# EAGLE schematic SCH1001-001-009-320 - ALU Bottom (EAGLE 9.4.2)

## Sheet 1 of 4
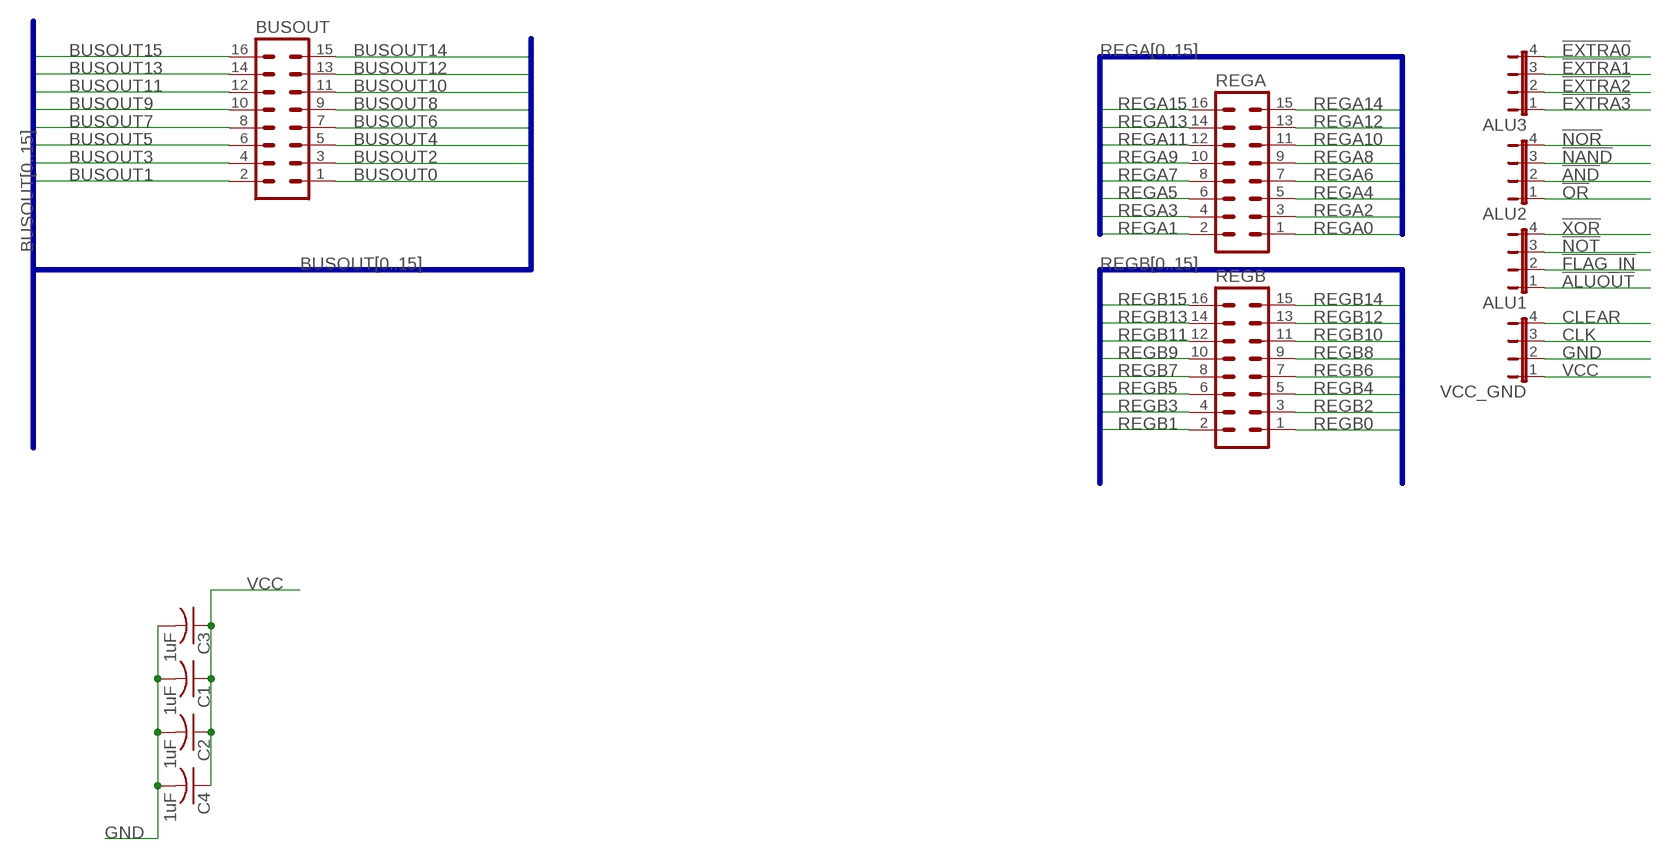
[diagram p0: schematic, sheet 1]

### Parts
ALU1  JP4E  [JP4]
ALU2  JP4E  [JP4]
ALU3  JP4E  [JP4]
BUSOUT  ML16  [ML16]
C1  1uF  C-USC1206  [C1206]
C2  1uF  C-USC1206  [C1206]
C3  1uF  C-USC1206  [C1206]
C4  1uF  C-USC1206  [C1206]
REGA  ML16  [ML16]
REGB  ML16  [ML16]
VCC_GND  JP4E  [JP4]

### Nets
!ALUOUT: ALU1.1
!AND: ALU2.2 ; also sheet 3
!EXTRA0: ALU3.4
!EXTRA1: ALU3.3
!EXTRA2: ALU3.2
!EXTRA3: ALU3.1
!FLAG_IN: ALU1.2
!NAND: ALU2.3 ; also sheet 2
!NOR: ALU2.4 ; also sheet 2
!NOT: ALU1.3 ; also sheet 2
!OR: ALU2.1 ; also sheet 3
!XOR: ALU1.4 ; also sheet 3
BUSOUT0: BUSOUT.1 ; also sheet 2,3
BUSOUT1: BUSOUT.2 ; also sheet 2,3
BUSOUT2: BUSOUT.3 ; also sheet 2,3
BUSOUT3: BUSOUT.4 ; also sheet 2,3
BUSOUT4: BUSOUT.5 ; also sheet 2,3
BUSOUT5: BUSOUT.6 ; also sheet 2,3
BUSOUT6: BUSOUT.7 ; also sheet 2,3
BUSOUT7: BUSOUT.8 ; also sheet 2,3
BUSOUT8: BUSOUT.9 ; also sheet 2,3
BUSOUT9: BUSOUT.10 ; also sheet 2,3
BUSOUT10: BUSOUT.11 ; also sheet 2,3
BUSOUT11: BUSOUT.12 ; also sheet 2,3
BUSOUT12: BUSOUT.13 ; also sheet 2,3
BUSOUT13: BUSOUT.14 ; also sheet 2,3
BUSOUT14: BUSOUT.15 ; also sheet 2,3
BUSOUT15: BUSOUT.16 ; also sheet 2,3
CLEAR: VCC_GND.4
CLK: VCC_GND.3
GND [power]: C1.2 C2.2 C3.2 C4.2 VCC_GND.2
REGA0: REGA.1 ; also sheet 2,3
REGA1: REGA.2 ; also sheet 2,3
REGA2: REGA.3 ; also sheet 2,3
REGA3: REGA.4 ; also sheet 2,3
REGA4: REGA.5 ; also sheet 2,3
REGA5: REGA.6 ; also sheet 2,3
REGA6: REGA.7 ; also sheet 2,3
REGA7: REGA.8 ; also sheet 2,3
REGA8: REGA.9 ; also sheet 2,3
REGA9: REGA.10 ; also sheet 2,3
REGA10: REGA.11 ; also sheet 2,3
REGA11: REGA.12 ; also sheet 2,3
REGA12: REGA.13 ; also sheet 2,3
REGA13: REGA.14 ; also sheet 2,3
REGA14: REGA.15 ; also sheet 2,3
REGA15: REGA.16 ; also sheet 2,3
REGB0: REGB.1 ; also sheet 2,3
REGB1: REGB.2 ; also sheet 2,3
REGB2: REGB.3 ; also sheet 2,3
REGB3: REGB.4 ; also sheet 2,3
REGB4: REGB.5 ; also sheet 2,3
REGB5: REGB.6 ; also sheet 2,3
REGB6: REGB.7 ; also sheet 2,3
REGB7: REGB.8 ; also sheet 2,3
REGB8: REGB.9 ; also sheet 2,3
REGB9: REGB.10 ; also sheet 2,3
REGB10: REGB.11 ; also sheet 2,3
REGB11: REGB.12 ; also sheet 2,3
REGB12: REGB.13 ; also sheet 2,3
REGB13: REGB.14 ; also sheet 2,3
REGB14: REGB.15 ; also sheet 2,3
REGB15: REGB.16 ; also sheet 2,3
VCC [power]: C1.1 C2.1 C3.1 C4.1 VCC_GND.1 ; also sheet 2,3

### Buses
REGB[0..15]
REGA[0..15]
BUSOUT[0..15]

## Sheet 2 of 4
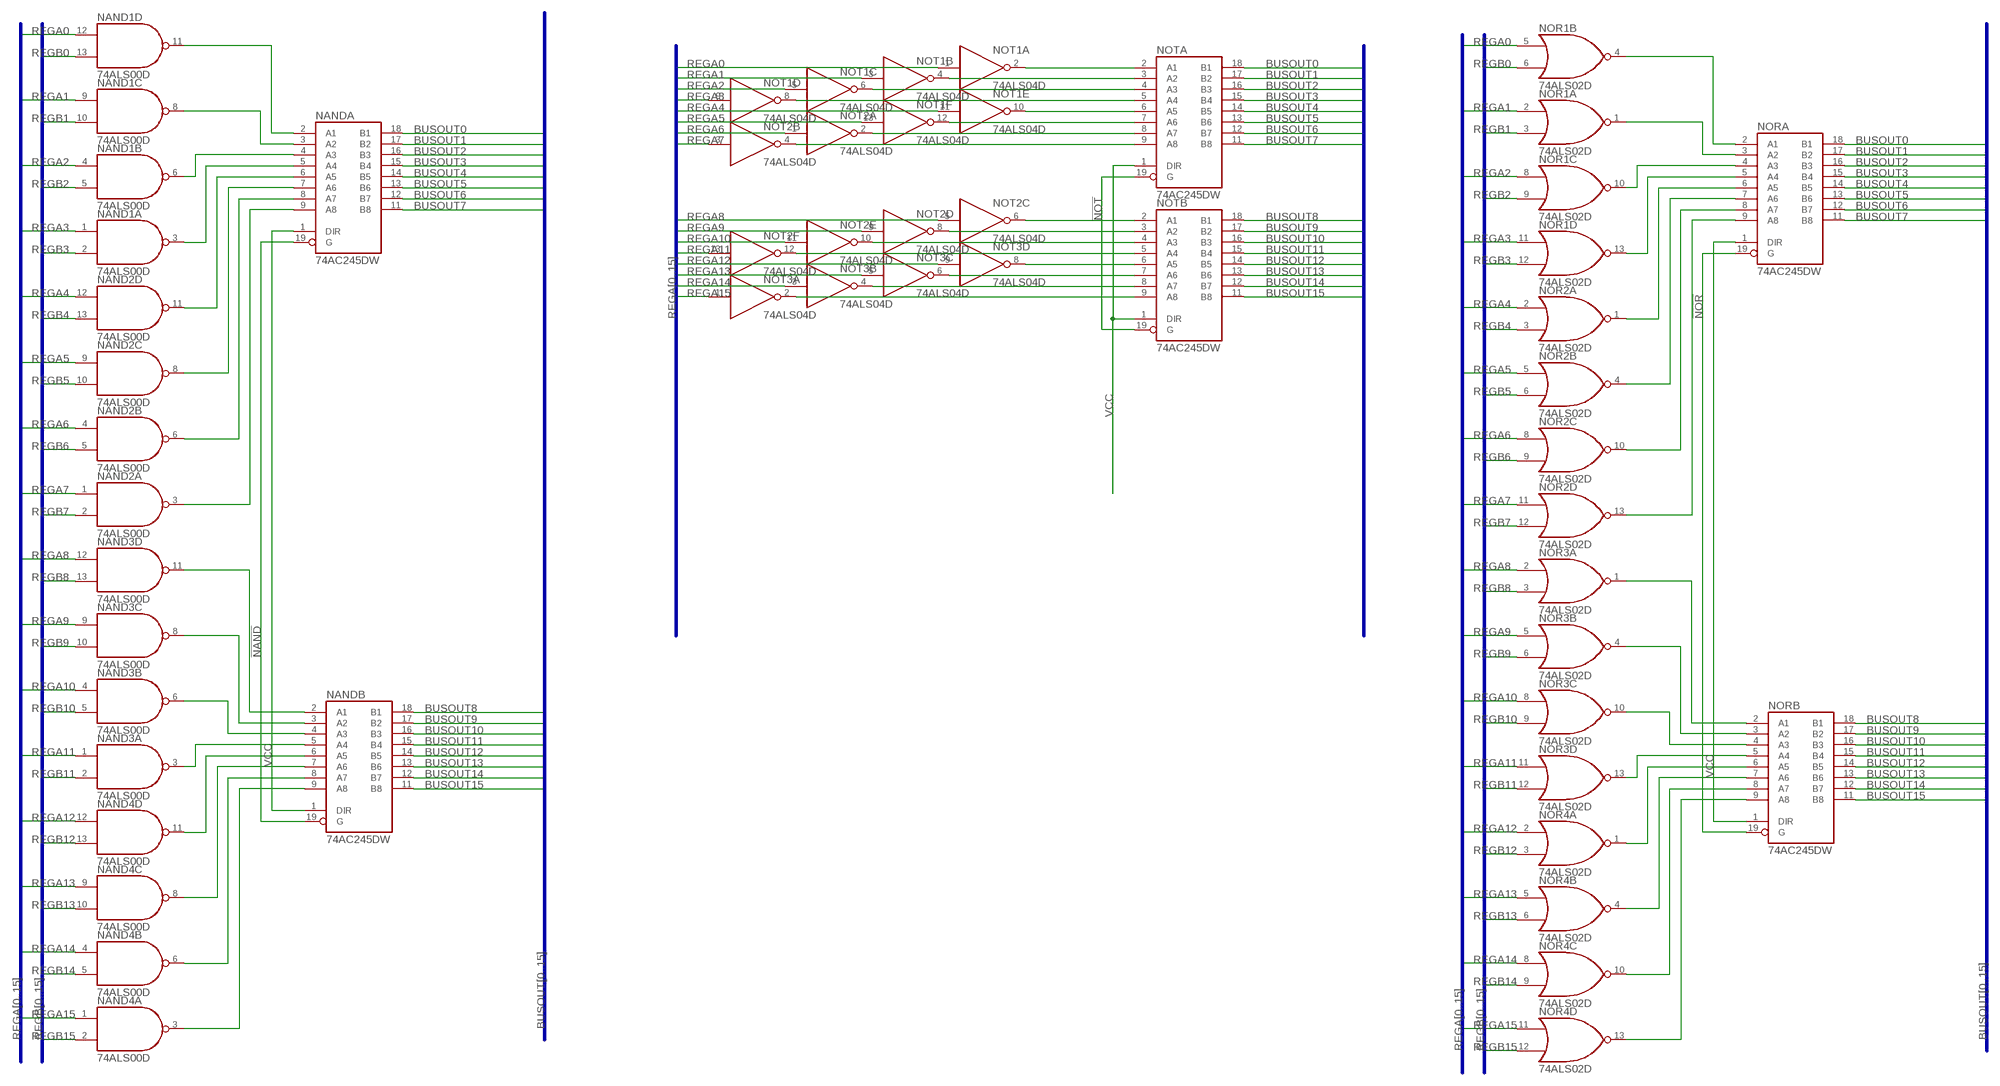
[diagram p1: schematic, sheet 2]

### Parts
NAND1  74ALS00D  [SO14]
NAND2  74ALS00D  [SO14]
NAND3  74ALS00D  [SO14]
NAND4  74ALS00D  [SO14]
NANDA  74AC245DW  [SO20W]
NANDB  74AC245DW  [SO20W]
NOR1  74ALS02D  [SO14]
NOR2  74ALS02D  [SO14]
NOR3  74ALS02D  [SO14]
NOR4  74ALS02D  [SO14]
NORA  74AC245DW  [SO20W]
NORB  74AC245DW  [SO20W]
NOT1  74ALS04D  [SO14]
NOT2  74ALS04D  [SO14]
NOT3  74ALS04D  [SO14]
NOTA  74AC245DW  [SO20W]
NOTB  74AC245DW  [SO20W]

### Nets
!NAND: NANDA.19(G) NANDB.19(G) ; also sheet 1
!NOR: NORA.19(G) NORB.19(G) ; also sheet 1
!NOT: NOTA.19(G) NOTB.19(G) ; also sheet 1
BUSOUT0: NANDA.18(B1) NORA.18(B1) NOTA.18(B1) ; also sheet 1,3
BUSOUT1: NANDA.17(B2) NORA.17(B2) NOTA.17(B2) ; also sheet 1,3
BUSOUT2: NANDA.16(B3) NORA.16(B3) NOTA.16(B3) ; also sheet 1,3
BUSOUT3: NANDA.15(B4) NORA.15(B4) NOTA.15(B4) ; also sheet 1,3
BUSOUT4: NANDA.14(B5) NORA.14(B5) NOTA.14(B5) ; also sheet 1,3
BUSOUT5: NANDA.13(B6) NORA.13(B6) NOTA.13(B6) ; also sheet 1,3
BUSOUT6: NANDA.12(B7) NORA.12(B7) NOTA.12(B7) ; also sheet 1,3
BUSOUT7: NANDA.11(B8) NORA.11(B8) NOTA.11(B8) ; also sheet 1,3
BUSOUT8: NANDB.18(B1) NORB.18(B1) NOTB.18(B1) ; also sheet 1,3
BUSOUT9: NANDB.17(B2) NORB.17(B2) NOTB.17(B2) ; also sheet 1,3
BUSOUT10: NANDB.16(B3) NORB.16(B3) NOTB.16(B3) ; also sheet 1,3
BUSOUT11: NANDB.15(B4) NORB.15(B4) NOTB.15(B4) ; also sheet 1,3
BUSOUT12: NANDB.14(B5) NORB.14(B5) NOTB.14(B5) ; also sheet 1,3
BUSOUT13: NANDB.13(B6) NORB.13(B6) NOTB.13(B6) ; also sheet 1,3
BUSOUT14: NANDB.12(B7) NORB.12(B7) NOTB.12(B7) ; also sheet 1,3
BUSOUT15: NANDB.11(B8) NORB.11(B8) NOTB.11(B8) ; also sheet 1,3
N$1: NOT1.2(A:O) NOTA.2(A1)
N$2: NOT1.10(E:O) NOTA.6(A5)
N$3: NOT1.4(B:O) NOTA.3(A2)
N$4: NOT1.12(F:O) NOTA.7(A6)
N$5: NOT2.2(A:O) NOTA.8(A7)
N$6: NOT1.6(C:O) NOTA.4(A3)
N$7: NOT1.8(D:O) NOTA.5(A4)
N$8: NOT2.4(B:O) NOTA.9(A8)
N$9: NOT2.6(C:O) NOTB.2(A1)
N$10: NOT3.8(D:O) NOTB.6(A5)
N$11: NOT2.8(D:O) NOTB.3(A2)
N$12: NOT3.6(C:O) NOTB.7(A6)
N$13: NOT3.4(B:O) NOTB.8(A7)
N$14: NOT2.10(E:O) NOTB.4(A3)
N$15: NOT2.12(F:O) NOTB.5(A4)
N$16: NOT3.2(A:O) NOTB.9(A8)
N$65: NAND1.11(D:O) NANDA.2(A1)
N$66: NAND1.8(C:O) NANDA.3(A2)
N$67: NAND1.6(B:O) NANDA.4(A3)
N$68: NAND1.3(A:O) NANDA.5(A4)
N$69: NAND2.11(D:O) NANDA.6(A5)
N$70: NAND2.8(C:O) NANDA.7(A6)
N$71: NAND2.6(B:O) NANDA.8(A7)
N$72: NAND2.3(A:O) NANDA.9(A8)
N$73: NAND3.11(D:O) NANDB.2(A1)
N$74: NAND3.8(C:O) NANDB.3(A2)
N$75: NAND3.6(B:O) NANDB.4(A3)
N$76: NAND3.3(A:O) NANDB.5(A4)
N$77: NAND4.11(D:O) NANDB.6(A5)
N$78: NAND4.8(C:O) NANDB.7(A6)
N$79: NAND4.6(B:O) NANDB.8(A7)
N$80: NAND4.3(A:O) NANDB.9(A8)
N$81: NOR1.4(B:O) NORA.2(A1)
N$82: NOR1.1(A:O) NORA.3(A2)
N$83: NOR1.10(C:O) NORA.4(A3)
N$84: NOR1.13(D:O) NORA.5(A4)
N$85: NOR2.1(A:O) NORA.6(A5)
N$86: NOR2.4(B:O) NORA.7(A6)
N$87: NOR2.10(C:O) NORA.8(A7)
N$88: NOR2.13(D:O) NORA.9(A8)
N$89: NOR3.1(A:O) NORB.2(A1)
N$90: NOR3.4(B:O) NORB.3(A2)
N$91: NOR3.10(C:O) NORB.4(A3)
N$92: NOR3.13(D:O) NORB.5(A4)
N$93: NOR4.1(A:O) NORB.6(A5)
N$94: NOR4.4(B:O) NORB.7(A6)
N$95: NOR4.10(C:O) NORB.8(A7)
N$96: NOR4.13(D:O) NORB.9(A8)
REGA0: NAND1.12(D:I0) NOR1.5(B:I0) NOT1.1(A:I) ; also sheet 1,3
REGA1: NAND1.9(C:I0) NOR1.2(A:I0) NOT1.3(B:I) ; also sheet 1,3
REGA2: NAND1.4(B:I0) NOR1.8(C:I0) NOT1.5(C:I) ; also sheet 1,3
REGA3: NAND1.1(A:I0) NOR1.11(D:I0) NOT1.9(D:I) ; also sheet 1,3
REGA4: NAND2.12(D:I0) NOR2.2(A:I0) NOT1.11(E:I) ; also sheet 1,3
REGA5: NAND2.9(C:I0) NOR2.5(B:I0) NOT1.13(F:I) ; also sheet 1,3
REGA6: NAND2.4(B:I0) NOR2.8(C:I0) NOT2.1(A:I) ; also sheet 1,3
REGA7: NAND2.1(A:I0) NOR2.11(D:I0) NOT2.3(B:I) ; also sheet 1,3
REGA8: NAND3.12(D:I0) NOR3.2(A:I0) NOT2.5(C:I) ; also sheet 1,3
REGA9: NAND3.9(C:I0) NOR3.5(B:I0) NOT2.9(D:I) ; also sheet 1,3
REGA10: NAND3.4(B:I0) NOR3.8(C:I0) NOT2.11(E:I) ; also sheet 1,3
REGA11: NAND3.1(A:I0) NOR3.11(D:I0) NOT2.13(F:I) ; also sheet 1,3
REGA12: NAND4.12(D:I0) NOR4.2(A:I0) NOT3.9(D:I) ; also sheet 1,3
REGA13: NAND4.9(C:I0) NOR4.5(B:I0) NOT3.5(C:I) ; also sheet 1,3
REGA14: NAND4.4(B:I0) NOR4.8(C:I0) NOT3.3(B:I) ; also sheet 1,3
REGA15: NAND4.1(A:I0) NOR4.11(D:I0) NOT3.1(A:I) ; also sheet 1,3
REGB0: NAND1.13(D:I1) NOR1.6(B:I1) ; also sheet 1,3
REGB1: NAND1.10(C:I1) NOR1.3(A:I1) ; also sheet 1,3
REGB2: NAND1.5(B:I1) NOR1.9(C:I1) ; also sheet 1,3
REGB3: NAND1.2(A:I1) NOR1.12(D:I1) ; also sheet 1,3
REGB4: NAND2.13(D:I1) NOR2.3(A:I1) ; also sheet 1,3
REGB5: NAND2.10(C:I1) NOR2.6(B:I1) ; also sheet 1,3
REGB6: NAND2.5(B:I1) NOR2.9(C:I1) ; also sheet 1,3
REGB7: NAND2.2(A:I1) NOR2.12(D:I1) ; also sheet 1,3
REGB8: NAND3.13(D:I1) NOR3.3(A:I1) ; also sheet 1,3
REGB9: NAND3.10(C:I1) NOR3.6(B:I1) ; also sheet 1,3
REGB10: NAND3.5(B:I1) NOR3.9(C:I1) ; also sheet 1,3
REGB11: NAND3.2(A:I1) NOR3.12(D:I1) ; also sheet 1,3
REGB12: NAND4.13(D:I1) NOR4.3(A:I1) ; also sheet 1,3
REGB13: NAND4.10(C:I1) NOR4.6(B:I1) ; also sheet 1,3
REGB14: NAND4.5(B:I1) NOR4.9(C:I1) ; also sheet 1,3
REGB15: NAND4.2(A:I1) NOR4.12(D:I1) ; also sheet 1,3
VCC [power]: NANDA.1(DIR) NANDB.1(DIR) NORA.1(DIR) NORB.1(DIR) NOTA.1(DIR) NOTB.1(DIR) ; also sheet 1,3
Unconnected: NOT3.10(E:O) NOT3.11(E:I) NOT3.12(F:O) NOT3.13(F:I)

### Buses
REGA[0..15]
BUSOUT[0..15]
REGB[0..15]

## Sheet 3 of 4
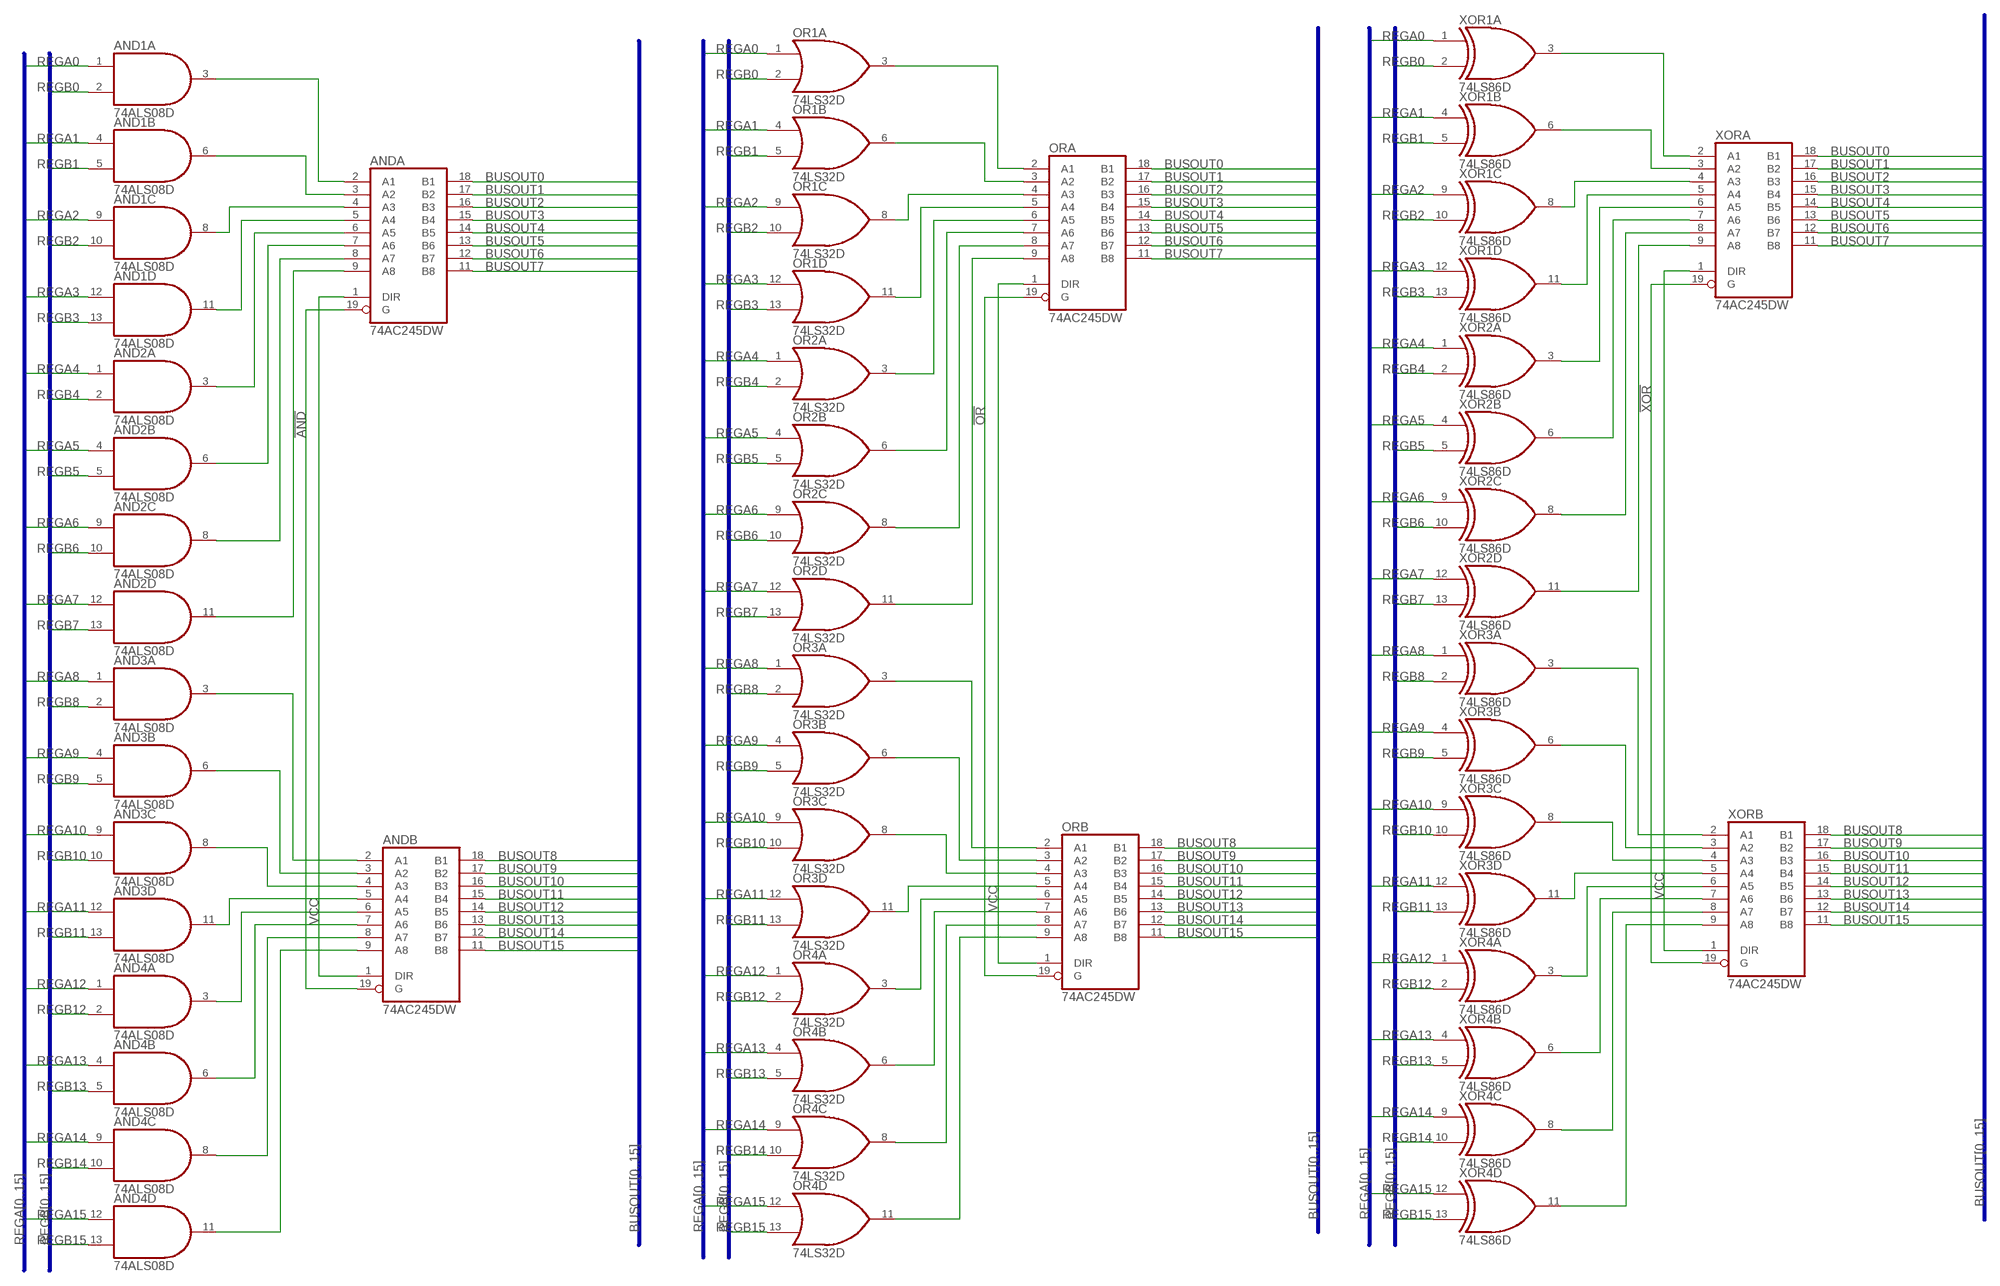
[diagram p2: schematic, sheet 3]

### Parts
AND1  74ALS08D  [SO14]
AND2  74ALS08D  [SO14]
AND3  74ALS08D  [SO14]
AND4  74ALS08D  [SO14]
ANDA  74AC245DW  [SO20W]
ANDB  74AC245DW  [SO20W]
OR1  74LS32D  [SO14]
OR2  74LS32D  [SO14]
OR3  74LS32D  [SO14]
OR4  74LS32D  [SO14]
ORA  74AC245DW  [SO20W]
ORB  74AC245DW  [SO20W]
XOR1  74LS86D  [SO14]
XOR2  74LS86D  [SO14]
XOR3  74LS86D  [SO14]
XOR4  74LS86D  [SO14]
XORA  74AC245DW  [SO20W]
XORB  74AC245DW  [SO20W]

### Nets
!AND: ANDA.19(G) ANDB.19(G) ; also sheet 1
!OR: ORA.19(G) ORB.19(G) ; also sheet 1
!XOR: XORA.19(G) XORB.19(G) ; also sheet 1
BUSOUT0: ANDA.18(B1) ORA.18(B1) XORA.18(B1) ; also sheet 1,2
BUSOUT1: ANDA.17(B2) ORA.17(B2) XORA.17(B2) ; also sheet 1,2
BUSOUT2: ANDA.16(B3) ORA.16(B3) XORA.16(B3) ; also sheet 1,2
BUSOUT3: ANDA.15(B4) ORA.15(B4) XORA.15(B4) ; also sheet 1,2
BUSOUT4: ANDA.14(B5) ORA.14(B5) XORA.14(B5) ; also sheet 1,2
BUSOUT5: ANDA.13(B6) ORA.13(B6) XORA.13(B6) ; also sheet 1,2
BUSOUT6: ANDA.12(B7) ORA.12(B7) XORA.12(B7) ; also sheet 1,2
BUSOUT7: ANDA.11(B8) ORA.11(B8) XORA.11(B8) ; also sheet 1,2
BUSOUT8: ANDB.18(B1) ORB.18(B1) XORB.18(B1) ; also sheet 1,2
BUSOUT9: ANDB.17(B2) ORB.17(B2) XORB.17(B2) ; also sheet 1,2
BUSOUT10: ANDB.16(B3) ORB.16(B3) XORB.16(B3) ; also sheet 1,2
BUSOUT11: ANDB.15(B4) ORB.15(B4) XORB.15(B4) ; also sheet 1,2
BUSOUT12: ANDB.14(B5) ORB.14(B5) XORB.14(B5) ; also sheet 1,2
BUSOUT13: ANDB.13(B6) ORB.13(B6) XORB.13(B6) ; also sheet 1,2
BUSOUT14: ANDB.12(B7) ORB.12(B7) XORB.12(B7) ; also sheet 1,2
BUSOUT15: ANDB.11(B8) ORB.11(B8) XORB.11(B8) ; also sheet 1,2
N$17: AND1.3(A:O) ANDA.2(A1)
N$18: AND1.6(B:O) ANDA.3(A2)
N$19: AND1.8(C:O) ANDA.4(A3)
N$20: AND1.11(D:O) ANDA.5(A4)
N$21: AND2.3(A:O) ANDA.6(A5)
N$22: AND2.6(B:O) ANDA.7(A6)
N$23: AND2.8(C:O) ANDA.8(A7)
N$24: AND2.11(D:O) ANDA.9(A8)
N$25: AND3.3(A:O) ANDB.2(A1)
N$26: AND3.6(B:O) ANDB.3(A2)
N$27: AND3.8(C:O) ANDB.4(A3)
N$28: AND3.11(D:O) ANDB.5(A4)
N$29: AND4.3(A:O) ANDB.6(A5)
N$30: AND4.6(B:O) ANDB.7(A6)
N$31: AND4.8(C:O) ANDB.8(A7)
N$32: AND4.11(D:O) ANDB.9(A8)
N$33: OR1.3(A:O) ORA.2(A1)
N$34: OR1.6(B:O) ORA.3(A2)
N$35: OR1.8(C:O) ORA.4(A3)
N$36: OR1.11(D:O) ORA.5(A4)
N$37: OR2.3(A:O) ORA.6(A5)
N$38: OR2.6(B:O) ORA.7(A6)
N$39: OR2.8(C:O) ORA.8(A7)
N$40: OR2.11(D:O) ORA.9(A8)
N$41: OR3.3(A:O) ORB.2(A1)
N$42: OR3.6(B:O) ORB.3(A2)
N$43: OR3.8(C:O) ORB.4(A3)
N$44: OR3.11(D:O) ORB.5(A4)
N$45: OR4.3(A:O) ORB.6(A5)
N$46: OR4.6(B:O) ORB.7(A6)
N$47: OR4.8(C:O) ORB.8(A7)
N$48: OR4.11(D:O) ORB.9(A8)
N$49: XOR1.3(A:O) XORA.2(A1)
N$50: XOR1.6(B:O) XORA.3(A2)
N$51: XOR1.8(C:O) XORA.4(A3)
N$52: XOR1.11(D:O) XORA.5(A4)
N$53: XOR2.3(A:O) XORA.6(A5)
N$54: XOR2.6(B:O) XORA.7(A6)
N$55: XOR2.8(C:O) XORA.8(A7)
N$56: XOR2.11(D:O) XORA.9(A8)
N$57: XOR3.3(A:O) XORB.2(A1)
N$58: XOR3.6(B:O) XORB.3(A2)
N$59: XOR3.8(C:O) XORB.4(A3)
N$60: XOR3.11(D:O) XORB.5(A4)
N$61: XOR4.3(A:O) XORB.6(A5)
N$62: XOR4.6(B:O) XORB.7(A6)
N$63: XOR4.8(C:O) XORB.8(A7)
N$64: XOR4.11(D:O) XORB.9(A8)
REGA0: AND1.1(A:I0) OR1.1(A:I0) XOR1.1(A:I0) ; also sheet 1,2
REGA1: AND1.4(B:I0) OR1.4(B:I0) XOR1.4(B:I0) ; also sheet 1,2
REGA2: AND1.9(C:I0) OR1.9(C:I0) XOR1.9(C:I0) ; also sheet 1,2
REGA3: AND1.12(D:I0) OR1.12(D:I0) XOR1.12(D:I0) ; also sheet 1,2
REGA4: AND2.1(A:I0) OR2.1(A:I0) XOR2.1(A:I0) ; also sheet 1,2
REGA5: AND2.4(B:I0) OR2.4(B:I0) XOR2.4(B:I0) ; also sheet 1,2
REGA6: AND2.9(C:I0) OR2.9(C:I0) XOR2.9(C:I0) ; also sheet 1,2
REGA7: AND2.12(D:I0) OR2.12(D:I0) XOR2.12(D:I0) ; also sheet 1,2
REGA8: AND3.1(A:I0) OR3.1(A:I0) XOR3.1(A:I0) ; also sheet 1,2
REGA9: AND3.4(B:I0) OR3.4(B:I0) XOR3.4(B:I0) ; also sheet 1,2
REGA10: AND3.9(C:I0) OR3.9(C:I0) XOR3.9(C:I0) ; also sheet 1,2
REGA11: AND3.12(D:I0) OR3.12(D:I0) XOR3.12(D:I0) ; also sheet 1,2
REGA12: AND4.1(A:I0) OR4.1(A:I0) XOR4.1(A:I0) ; also sheet 1,2
REGA13: AND4.4(B:I0) OR4.4(B:I0) XOR4.4(B:I0) ; also sheet 1,2
REGA14: AND4.9(C:I0) OR4.9(C:I0) XOR4.9(C:I0) ; also sheet 1,2
REGA15: AND4.12(D:I0) OR4.12(D:I0) XOR4.12(D:I0) ; also sheet 1,2
REGB0: AND1.2(A:I1) OR1.2(A:I1) XOR1.2(A:I1) ; also sheet 1,2
REGB1: AND1.5(B:I1) OR1.5(B:I1) XOR1.5(B:I1) ; also sheet 1,2
REGB2: AND1.10(C:I1) OR1.10(C:I1) XOR1.10(C:I1) ; also sheet 1,2
REGB3: AND1.13(D:I1) OR1.13(D:I1) XOR1.13(D:I1) ; also sheet 1,2
REGB4: AND2.2(A:I1) OR2.2(A:I1) XOR2.2(A:I1) ; also sheet 1,2
REGB5: AND2.5(B:I1) OR2.5(B:I1) XOR2.5(B:I1) ; also sheet 1,2
REGB6: AND2.10(C:I1) OR2.10(C:I1) XOR2.10(C:I1) ; also sheet 1,2
REGB7: AND2.13(D:I1) OR2.13(D:I1) XOR2.13(D:I1) ; also sheet 1,2
REGB8: AND3.2(A:I1) OR3.2(A:I1) XOR3.2(A:I1) ; also sheet 1,2
REGB9: AND3.5(B:I1) OR3.5(B:I1) XOR3.5(B:I1) ; also sheet 1,2
REGB10: AND3.10(C:I1) OR3.10(C:I1) XOR3.10(C:I1) ; also sheet 1,2
REGB11: AND3.13(D:I1) OR3.13(D:I1) XOR3.13(D:I1) ; also sheet 1,2
REGB12: AND4.2(A:I1) OR4.2(A:I1) XOR4.2(A:I1) ; also sheet 1,2
REGB13: AND4.5(B:I1) OR4.5(B:I1) XOR4.5(B:I1) ; also sheet 1,2
REGB14: AND4.10(C:I1) OR4.10(C:I1) XOR4.10(C:I1) ; also sheet 1,2
REGB15: AND4.13(D:I1) OR4.13(D:I1) XOR4.13(D:I1) ; also sheet 1,2
VCC [power]: ANDA.1(DIR) ANDB.1(DIR) ORA.1(DIR) ORB.1(DIR) XORA.1(DIR) XORB.1(DIR) ; also sheet 1,2

### Buses
REGA[0..15]
REGB[0..15]
BUSOUT[0..15]

## Sheet 4 of 4

## Power pins joined to a net without a drawn wire
GND: AND1.7(P:GND) AND2.7(P:GND) AND3.7(P:GND) AND4.7(P:GND) ANDA.10(GND) ANDB.10(GND) NAND1.7(P:GND) NAND2.7(P:GND) NAND3.7(P:GND) NAND4.7(P:GND) NANDA.10(GND) NANDB.10(GND) NOR1.7(P:GND) NOR2.7(P:GND) NOR3.7(P:GND) NOR4.7(P:GND) NORA.10(GND) NORB.10(GND) NOT1.7(P:GND) NOT2.7(P:GND) NOT3.7(P:GND) NOTA.10(GND) NOTB.10(GND) OR1.7(P:GND) OR2.7(P:GND) OR3.7(P:GND) OR4.7(P:GND) ORA.10(GND) ORB.10(GND) XOR1.7(P:GND) XOR2.7(P:GND) XOR3.7(P:GND) XOR4.7(P:GND) XORA.10(GND) XORB.10(GND)
VCC: AND1.14(P:VCC) AND2.14(P:VCC) AND3.14(P:VCC) AND4.14(P:VCC) ANDA.20(VCC) ANDB.20(VCC) NAND1.14(P:VCC) NAND2.14(P:VCC) NAND3.14(P:VCC) NAND4.14(P:VCC) NANDA.20(VCC) NANDB.20(VCC) NOR1.14(P:VCC) NOR2.14(P:VCC) NOR3.14(P:VCC) NOR4.14(P:VCC) NORA.20(VCC) NORB.20(VCC) NOT1.14(P:VCC) NOT2.14(P:VCC) NOT3.14(P:VCC) NOTA.20(VCC) NOTB.20(VCC) OR1.14(P:VCC) OR2.14(P:VCC) OR3.14(P:VCC) OR4.14(P:VCC) ORA.20(VCC) ORB.20(VCC) XOR1.14(P:VCC) XOR2.14(P:VCC) XOR3.14(P:VCC) XOR4.14(P:VCC) XORA.20(VCC) XORB.20(VCC)

## Library data of the parts
ALU1-ALU3 VCC_GND = jumper:JP4E: JUMPER
AND1-AND4 = 74xx-us:74*08: Quad 2-input AND gate
ANDA ANDB NANDA NANDB NORA NORB NOTA NOTB ORA ORB XORA XORB = 74xx-eu:74*245: Octal BUS TRANSCEIVER, 3-state
BUSOUT REGA REGB = con-harting-ml:ML16: HARTING; OC_FARNELL: unknown; OC_NEWARK: unknown
C1-C4 = rcl:C-US: CAPACITOR, American symbol; SPICEPREFIX: C
NAND1-NAND4 = 74xx-us:74*00: Quad 2-input NAND gate
NOR1-NOR4 = 74xx-us:74*02: Quad 2-input NOR gate
NOT1-NOT3 = 74xx-us:74*04: Hex INVERTER
OR1-OR4 = 74xx-us:74*32: Quad 2-input OR gate
XOR1-XOR4 = 74xx-us:74*86: Quad 2-input EXCLUSIV-OR (XOR) gate

## Net classes
1 power: width 0.457 mm